# Altium schematic sheet JTAG.schdoc
size 163 x 86 mm
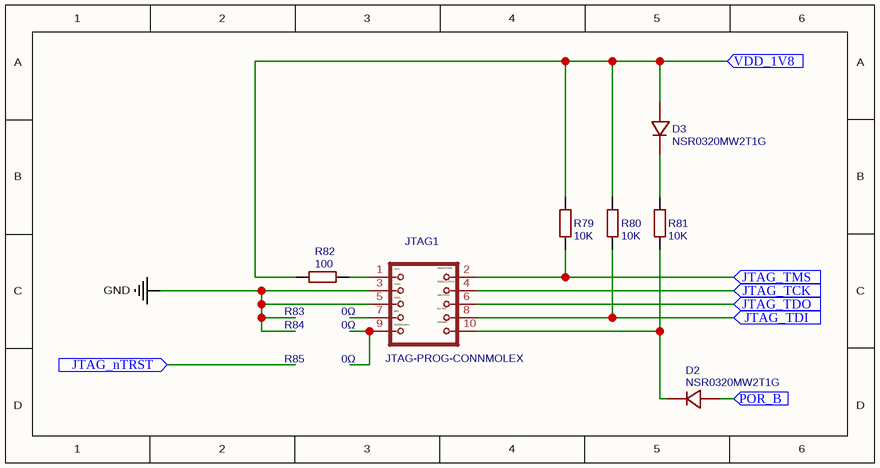
[diagram p0: JTAG.schdoc]

## Parts
D2  NSR0320MW2T1G  [SOD-323_L1.8-W1.3-LS2.5-RD]
D3  NSR0320MW2T1G  [SOD-323_L1.8-W1.3-LS2.5-RD]
JTAG1  JTAG-PROG-CONNMOLEX  [JTAG-10PIN-2.54MM-PTH]
R79  10K  [R0402]
R80  10K  [R0402]
R81  10K  [R0402]
R82  100  [R0402]
R83  0Ω  [1206]
R84  0Ω  [1206]
R85  0Ω  [1206]

## Ports
JTAG_nTRST (in), JTAG_TCK (in), JTAG_TDI (in), JTAG_TDO (in), JTAG_TMS (in), POR_B (in), VDD_1V8 (in)

## Nets
GND: JTAG1.3 JTAG1.5
JTAG_TCK: JTAG1.4 ; port JTAG_TCK
JTAG_TDI: JTAG1.8 R80.1 ; port JTAG_TDI
JTAG_TDO: JTAG1.6 ; port JTAG_TDO
JTAG_TMS: JTAG1.2 R79.1 ; port JTAG_TMS
POR_B: D2.2(A) ; port POR_B
VDD_1V8: D3.2(A) R79.2 R80.2 R82.1 ; port VDD_1V8
NetD2_1: D2.1(C) JTAG1.10 R81.1
NetD3_1: D3.1(C) R81.2
NetJTAG1_1: JTAG1.1 R82.2

Not connected (* = marked no-connect by the designer): JTAG1 7 9

## Notes on the sheet
- (in symbol JTAG-PROG-CONNMOLEX) VCC; SWDIOTMS; GND; SWDCLKTCK; SWOTDO; KEY; NCTDI; GNDDetect; nRESET

## Library data of the parts
D2 D3 = NSR0320MW2T1G: BOM_Manufacturer: ON; SMT Type: Extend; BOM_Supplier: LCSC; BOM_Manufacturer Part: NSR0320MW2T1G; image: //image.lceda.cn/szlcsc/C48192.jpg; BOM_Supplier Part: C48192; BOM_JLCPCB SMD: Yes; spicePre: D; spiceSymbolName: NSR0320MW2T1G
JTAG1 = JTAG-PROG-CONNMOLEX: description: JTAG Program Connector; Contributor: PatternAgents; spicePre: J; spiceSymbolName: JTAG-PROG-CONNMOLEX
R79-R81 = 10K: BOM_Manufacturer: UniOhm; BOM_Manufacturer Part: 0402WGF1002TCE; nameAlias: Resistance (Ohms); SMT Type: Basic; BOM_Supplier: LCSC; BOM_Supplier Part: C25744; BOM_JLCPCB SMD: Yes; spicePre: R; spiceSymbolName: 0402WGF1002TCE
R82 = 100: BOM_Manufacturer: UniOhm; BOM_Manufacturer Part: 0402WGF1000TCE; nameAlias: Resistance (Ohms); SMT Type: Basic; BOM_Supplier: LCSC; BOM_Supplier Part: C25076; BOM_JLCPCB SMD: Yes; spicePre: R; spiceSymbolName: 0402WGF1000TCE
R83-R85 = 0Ω: BOM_Manufacturer Part: 0R(000) ±1%; Value: 0Ω; BOM_Supplier Part: undefined; BOM_Supplier: LCSC; spicePre: R; spiceSymbolName: 0Ω